# EAGLE design Wave Buoy - Arduino UNO (EAGLE 8.7.0)
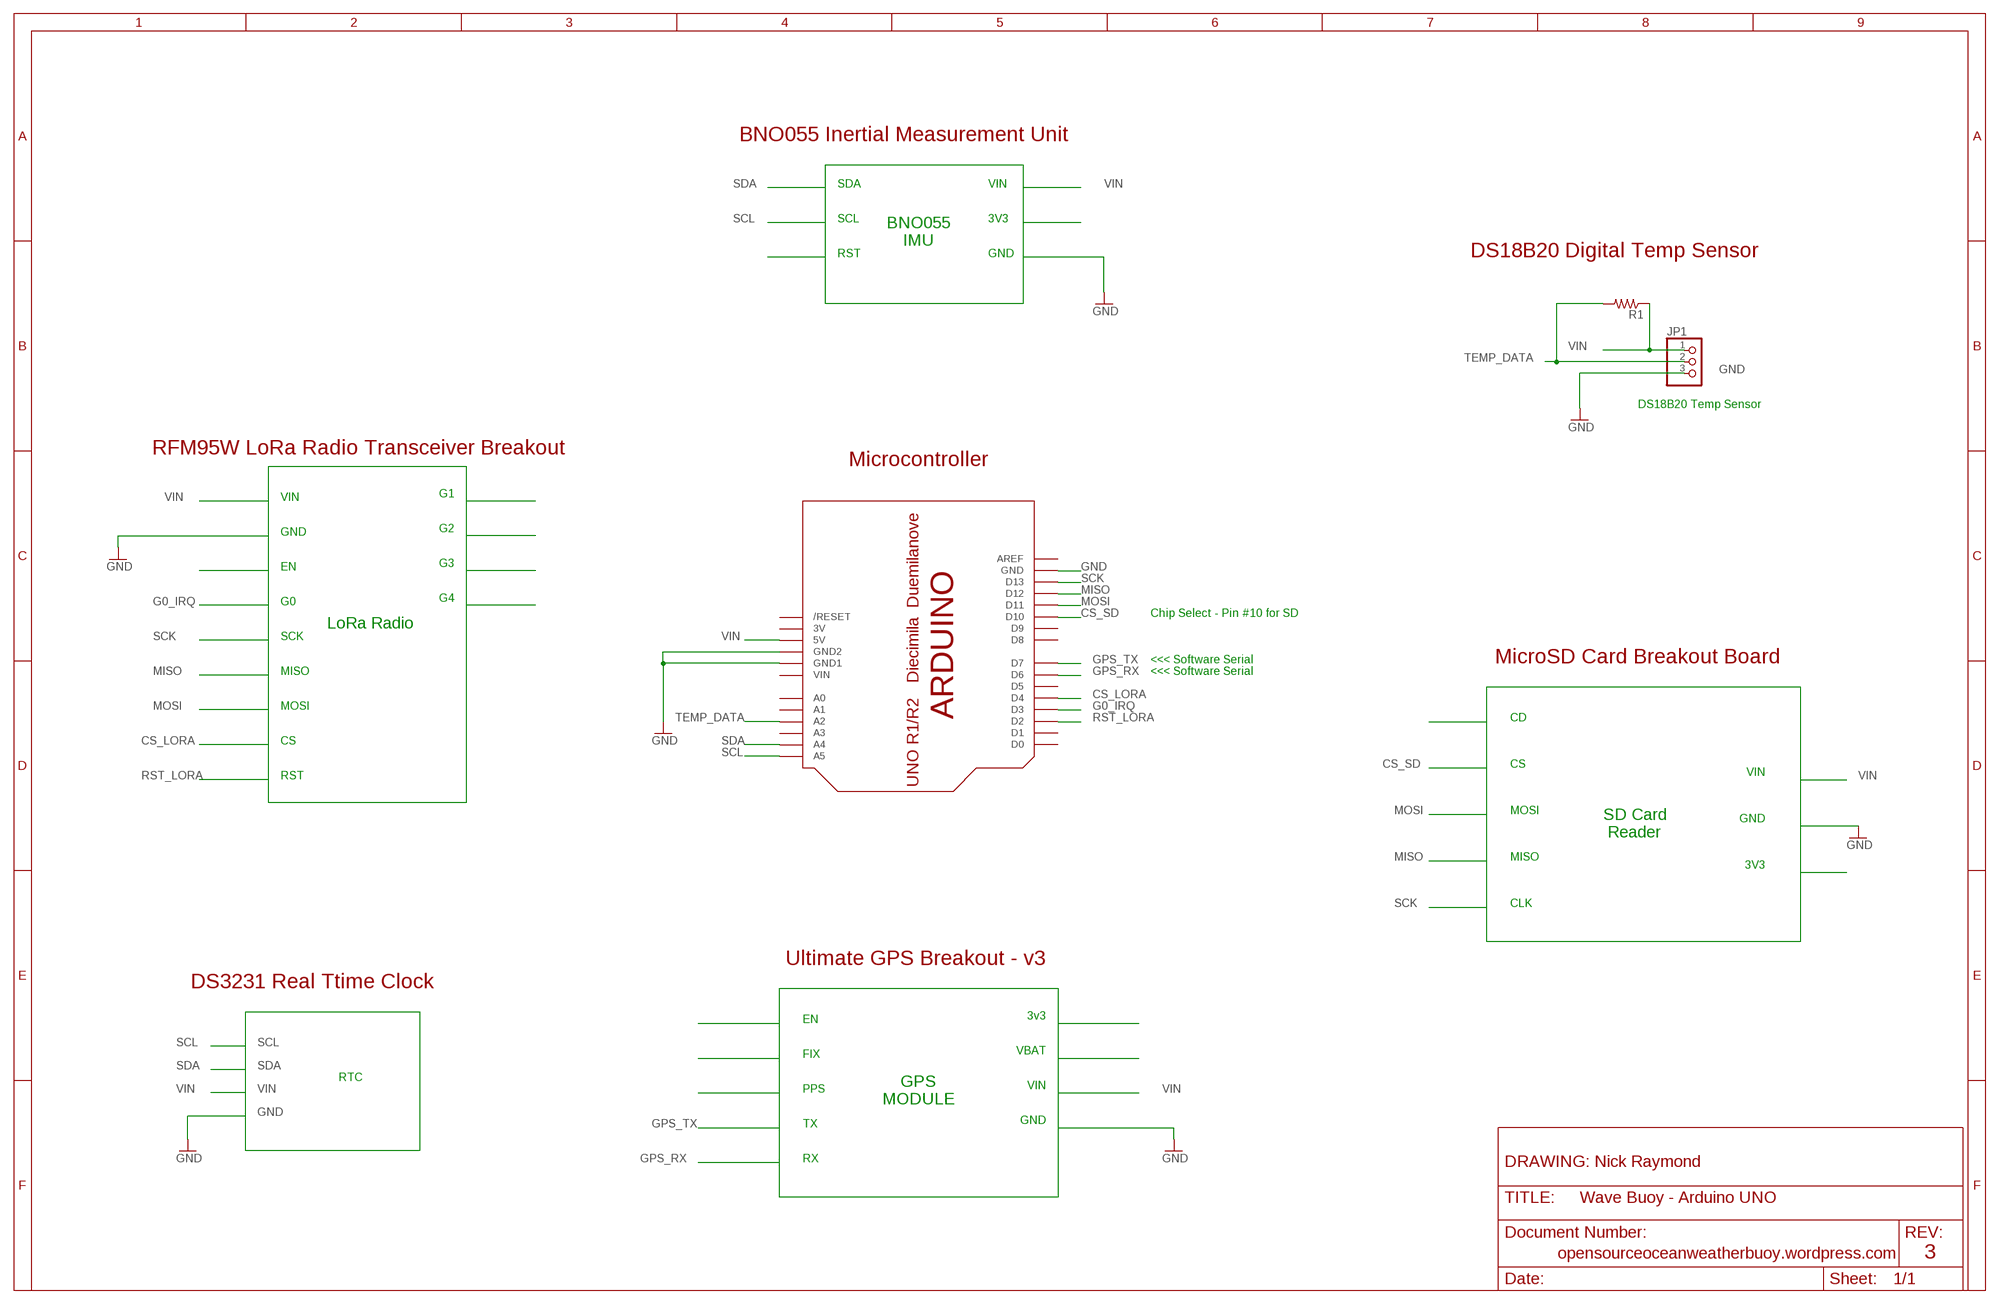
[diagram p0: schematic, sheet 1]

## Parts
JP1  PINHD-1X3CB  [1X03-CLEANBIG]
R1  FLIPFLOP-RES  [0805-THM]
U$1  ARDUINO-NODIM  [ARDUINO-NODIM]

## Nets
CS_LORA: U$1.D4
CS_SD: U$1.D10
G0_IRQ: U$1.D3
GND: JP1.3 U$1.GND U$1.GND1 U$1.GND2
GPS_RX: U$1.D6
GPS_TX: U$1.D7
MISO: U$1.D12
MOSI: U$1.D11
RST_LORA: U$1.D2
SCK: U$1.D13
SCL: U$1.A5
SDA: U$1.A4
TEMP_DATA: JP1.2 R1.2 U$1.A2
VIN: JP1.1 R1.1 U$1.5V
Unconnected: U$1.A0 U$1.A1 U$1.A3 U$1.AREF U$1.D0 U$1.D1 U$1.D5 U$1.D8 U$1.D9 U$1.RESET(/RESET)

## Notes on the sheet
- BNO055 Inertial Measurement Unit
- SDA | VIN
- SCL | 3V3
- BNO055
  IMU
- RST | GND | DS18B20 Digital Temp Sensor
- DS18B20 Temp Sensor
- RFM95W LoRa Radio Transceiver Breakout
- Microcontroller
- G1
- VIN
- G2
- GND
- G3
- EN
- G4
- G0
- Chip Select - Pin #10 for SD
- LoRa Radio
- SCK
- <<< Software Serial | MicroSD Card Breakout Board
- MISO | <<< Software Serial
- MOSI
- CD
- CS
- CS | VIN
- RST
- MOSI | GND
- SD Card
   Reader
- MISO | 3V3
- CLK
- Ultimate GPS Breakout - v3
- DS3231 Real Ttime Clock
- 3v3
- EN
- VBAT
- FIX
- RTC | VIN
- PPS
- GPS
  MODULE
- GND
- TX
- RX
- DRAWING: Nick Raymond
- opensourceoceanweatherbuoy.wordpress.com | 3

## Power pins joined to a net without a drawn wire
3V: U$1.3V
VIN: U$1.VIN

## Library data of the parts
JP1 = adafruit:PINHD-1X3: PIN HEADER
R1 = Nick_resistor:FLIPFLOP-RES: Flip Flop resistor An 0805 resistor inside a standard 1/4W 5% resistor. Makes for easy mods
U$1 = adafruit:ARDUINO: Arduino Diecimila/Duemilanove Make a shield with ease, this package has all the named pins as well as the two mounting drill holes and an outline of the USB and DC power connector. The outline is on the DIMENSION layer, so if your board house uses it they will cut the outline to match. http://www.ladyada.net/library/pcb/eaglelibrary.html

## Board
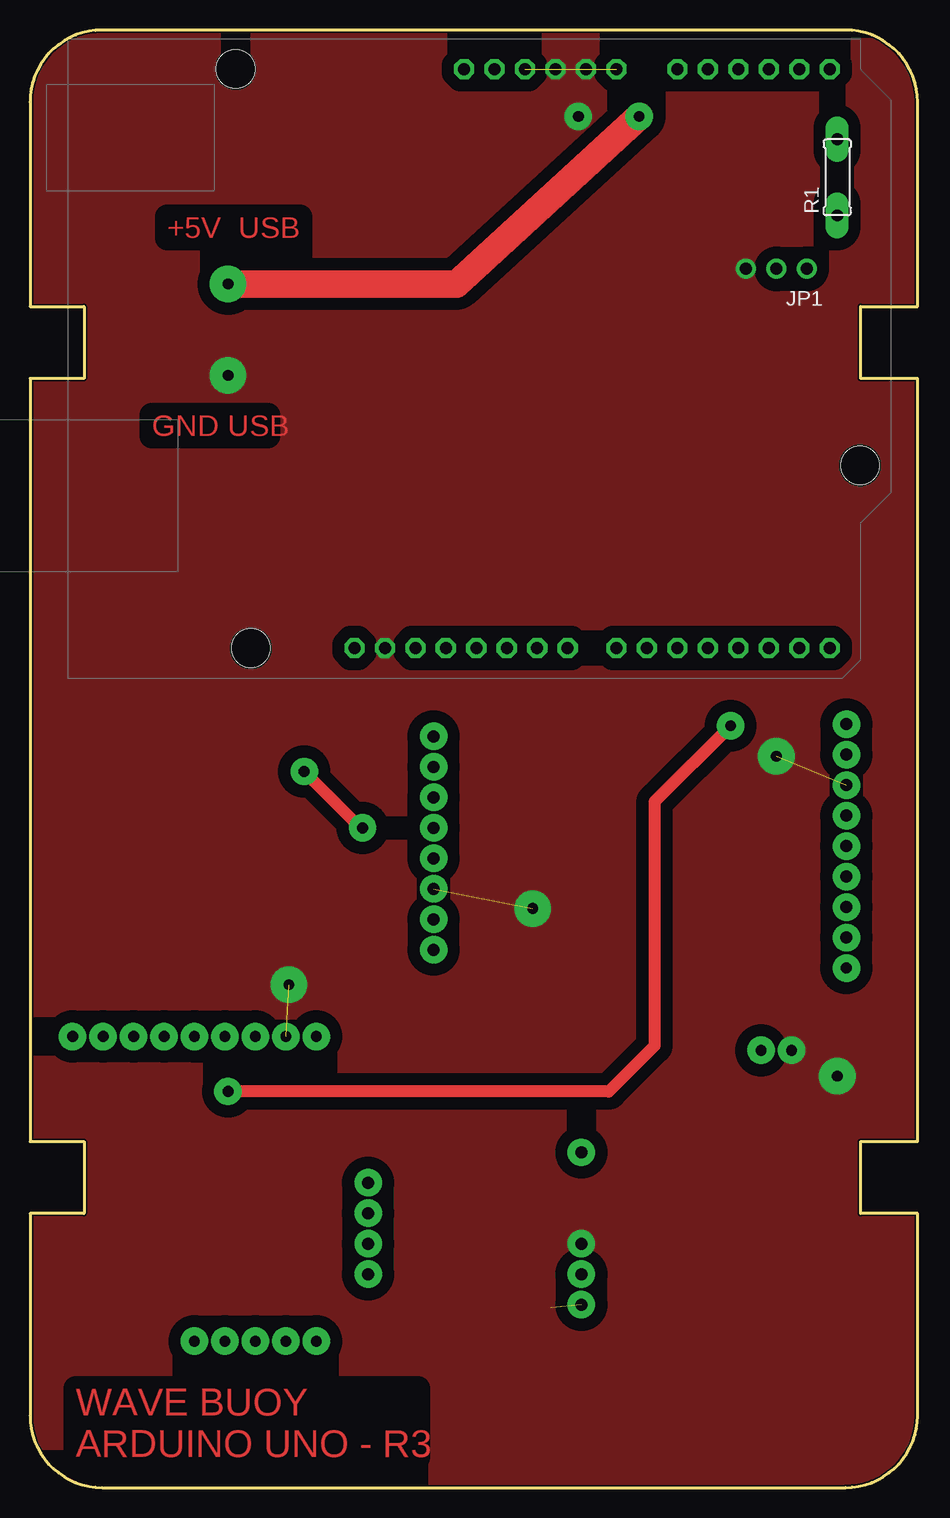
[diagram p1: board, top side]
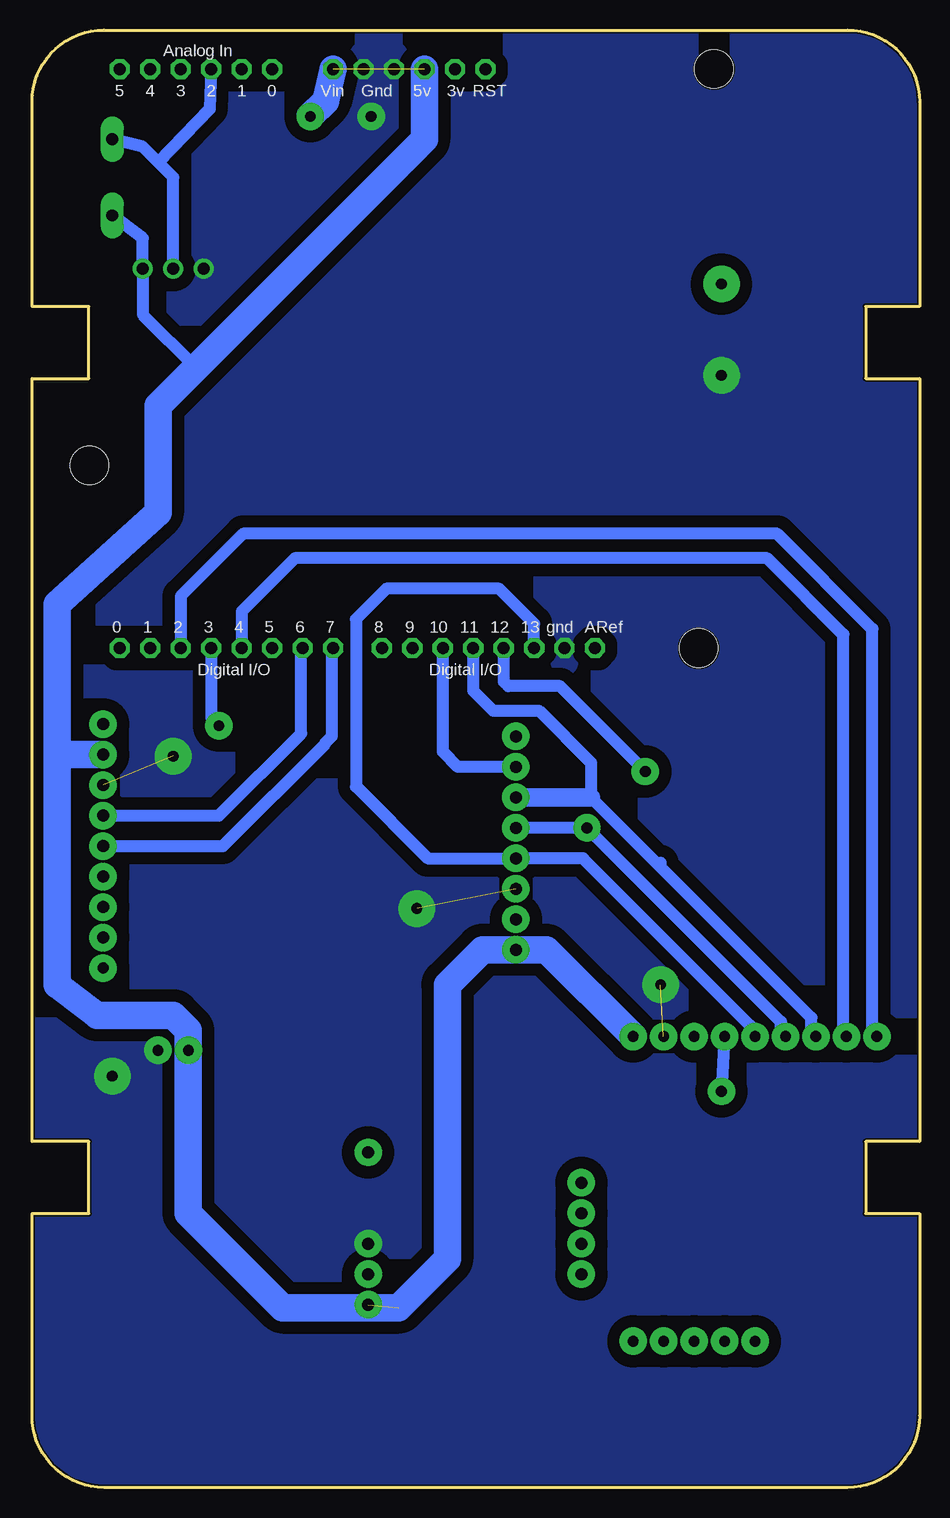
[diagram p2: board, bottom side, seen from below]

Size 74 x 121.5 mm. Coordinates in mm from the lower left corner, seen from the top.
Outline: 0,22.85 0,6 arc90 6,0 68,0 arc90 74,6 74,22.85 69.26,22.85 69.26,28.85 74,28.85 74,92.46 69.26,92.46 69.26,98.46 74,98.46 74,115.5 arc90 68,121.5 6,121.5 arc90 0,115.5 0,98.46 4.5,98.46 4.5,92.46 0,92.46 0,28.85 4.5,28.85 4.5,22.85 0,22.85
Copper layers (1*16): Top 0.035mm / dielectric 1.5mm / Bottom 0.035mm
Design rules "default *": minimum track width 6mil, minimum drill 0.35mm, track to track 40mil, track to pad 20mil, pad to pad 6mil, via to via 6mil, smd to smd 6mil, copper to edge 5mil, drill to drill 6mil, minimum pad ring 10mil, minimum via ring 8mil, stop-mask expansion 4mil, vias tented up to drill 0mil, thermal gap 10mil

### Footprints (pad centres in the part's own frame; a part is rotated, then mirrored left to right if it is on the bottom)
1X03-CLEANBIG = drill 1.016 pad 1.676: 1 -2.54,0; 2 0,0; 3 2.54,0
0805-THM = drill 0.991 pad 1.905 long: 1 -3.175,0 | drill 1.003 pad 1.905 long: 2 3.175,0
ARDUINO-NODIM = drill 1 pad 1.676 octagon: 3V 35.56,2.54; 5V 38.1,2.54; A0 50.8,2.54; A1 53.34,2.54; A2 55.88,2.54; A3 58.42,2.54; A4 60.96,2.54; A5 63.5,2.54; AREF 23.876,50.8; D0 63.5,50.8; D1 60.96,50.8; D2 58.42,50.8; D3 55.88,50.8; D4 53.34,50.8; D5 50.8,50.8; D6 48.26,50.8; D7 45.72,50.8; D8 41.656,50.8; D9 39.116,50.8; D10 36.576,50.8; D11 34.036,50.8; D12 31.496,50.8; D13 28.956,50.8; GND 26.416,50.8; GND1 43.18,2.54; GND2 40.64,2.54; RESET 33.02,2.54; VIN 45.72,2.54 | hole 3.2: 15.24,50.8; 66.04,35.56; 13.97,2.54

### Placement (x,y rotation side)
JP1  62.23,101.6 180 top
R1  67.31,109.22 90 top
U$1  3.17,120.78 180 bottom

### Tracks (layer width: path | path; a pad name or v marks a point on that pad's centre or on a via)
3V1  (via drill 1 pad 2.29)
  other vias: 45.97,17.78
3V2  (via drill 0.9 pad 2.29)
  other vias: 68.07,43.31
3V4  (via drill 1 pad 2.29)
  other vias: 33.66,47.37
CD_SD1  (via drill 1 pad 2.29)
  other vias: 33.66,62.61 33.66,62.61
CS_LORA  (via drill 0.9 pad 2.29)
  Bottom 1.016: v6.1,37.59 6.35,37.85 6.35,71.12 12.7,77.47 52.07,77.47 56.52,73.03 U$1.D4
CS_SD  (via drill 1 pad 2.29)
  Bottom 1.016: v33.66,60.07 38.48,60.07 39.75,61.34 U$1.D10
EN1  (via drill 0.9 pad 2.29)
  other vias: 18.8,37.59
EN_GPS1  (via drill 1 pad 2.29)
  other vias: 68.07,45.85
FIX_GPS1  (via drill 1 pad 2.29)
  other vias: 68.07,50.93
G0_IRQ  (via drill 0.9 pad 2.29)
  Top 1.016: v58.42,63.5 52.07,57.15 52.07,36.83 48.26,33.02 v16.51,33.02
  Bottom 1.016: U$1.D3 59.05,64.14 v58.42,63.5 | v16.26,37.59 v16.51,33.02
GND  (via drill 0.9 pad 2.29, 0.9 pad 3.05, 1 pad 2.29)  (3 unrouted)
  other vias: 63.5,36.45 21.34,37.59 45.97,20.32 33.66,49.91 68.07,58.55 41.91,48.26 67.31,34.29 62.23,60.96 45.72,114.3 16.51,92.71 21.59,41.91
  pour Top: -1.27,124.46 78.74,124.46 80.01,125.73 80.01,0 78.74,-1.27 77.47,-2.54 -2.54,-2.54 -2.54,124.46
  pour Bottom (isolate 0.025): 76.2,124.46 77.47,123.19 77.47,0 74.93,-2.54 -2.54,-2.54 -2.54,124.46
GPS_RX  (via drill 1 pad 2.29)
  Bottom 1.016: v68.07,56.01 58.42,56.01 51.56,62.87 51.56,69.85 U$1.D6
GPS_TX  (via drill 1 pad 2.29)
  Bottom 1.016: v68.07,53.47 58.09,53.47 49.53,62.02 49.53,62.1 49.02,62.61 49.02,69.85 U$1.D7
MISO  (via drill 0.9 pad 2.29, 1 pad 2.29)
  Top 1.016: v22.86,59.69 27.56,54.99 v27.73,54.99
  Bottom 1.016: v11.18,37.59 11.56,37.97 11.56,38.82 v27.73,54.99 v33.66,54.99 | U$1.D12 34.67,67.18 34.29,66.8 29.97,66.8 v22.86,59.69
MOSI  (via drill 0.9 pad 2.29, 1 pad 2.29)
  Bottom 1.016: v8.64,37.59 9.02,37.97 9.02,39.15 21.59,51.73 | 21.59,51.73 27.39,57.53 27.39,60.41 31.75,64.77 35.56,64.77 37.21,66.42 U$1.D11 | 21.59,52.07 21.59,51.73
  Bottom 1.524: 27.39,57.53 30.48,57.53 v33.66,57.53
N$7  (via drill 1 pad 2.29)
  other vias: 28.19,17.78
N$8  (via drill 1 pad 2.29)
  other vias: 28.19,22.86
N$11  (via drill 1 pad 2.29)
  other vias: 28.19,20.32
N$12  (via drill 1 pad 2.29)
  other vias: 28.19,25.4
PPS_GPS1  (via drill 1 pad 2.29)
  other vias: 68.07,63.63
RST1  (via drill 1 pad 2.29)
  other vias: 45.97,27.94
RST_LORA  (via drill 0.9 pad 2.29)
  Bottom 1.016: v3.56,37.59 3.94,37.97 3.94,71.58 11.86,79.5 56.39,79.5 61.59,74.3 U$1.D2
S$6  (via drill 0.9 pad 2.29)
  other vias: 23.88,12.19
S$7  (via drill 0.9 pad 2.29)
  other vias: 21.34,12.19
S$8  (via drill 0.9 pad 2.29)
  other vias: 18.8,12.19
S$9  (via drill 0.9 pad 2.29)
  other vias: 16.26,12.19
S$10  (via drill 0.9 pad 2.29)
  other vias: 13.72,12.19
SCK  (via drill 0.9 pad 2.29, 1 pad 2.29)
  Bottom 1.016: v13.72,37.59 14.1,37.97 14.1,38.49 28.06,52.45 v33.66,52.45 41.02,52.45 46.99,58.42 46.99,72.39 44.45,74.93 35.05,74.93 32.13,72.01 U$1.D13
TEMP_DATA
  Bottom 1.016: JP1.2 62.23,109.22 63.5,110.49 | 63.5,110.49 64.77,111.76 R1.2 | U$1.A2 59.18,114.94 63.5,110.49
VBAT_GPS1  (via drill 1 pad 2.29)
  other vias: 68.07,48.39
VIN  (via drill 0.9 pad 2.29, 0.9 pad 3.05, 1 pad 2.29)  (2 unrouted)
  Top 2.286: v50.8,114.3 35.56,100.33 v16.51,100.33
  Bottom 1.016: 60.33,93.34 64.77,97.79 JP1.1 64.77,104.14 R1.1
  Bottom 2.286: v23.88,37.59 31.11,44.83 v33.66,44.83 36.45,44.83 39.37,41.91 39.37,19.05 43.43,14.99 53.09,14.99 60.96,22.86 v60.96,36.45 60.96,38.1 62.23,39.37 68.58,39.37 71.88,41.91 71.88,61.09 | v68.07,61.09 71.88,61.09 | 71.88,61.09 71.88,73.66 63.5,81.28 63.5,90.17 60.33,93.34 41.27,112.39 U$1.5V | U$1.VIN 49.53,115.57 v50.8,114.3
  other vias: 45.97,15.24

### Text on the board
Top: +5V USB | GND USB | WAVE BUOY / ARDUINO UNO - R3
Reference: PPS | CD | VIN | CS | GND | DI | RX | GPS Module | DO | TX | SD Card Reader | CLK | FIX | GND | VBAT | 3V3 | EN | VIN | 3V3 | RST | CS | MOSI | MISO | SCK | G0 | EN | GND | VIN | SCL | SDA | VIN | GND | RST | LoRa Radio | SCL | SDA | GND | G5 | G4 | G3 | G2 | G1 | 3v3 | Vin